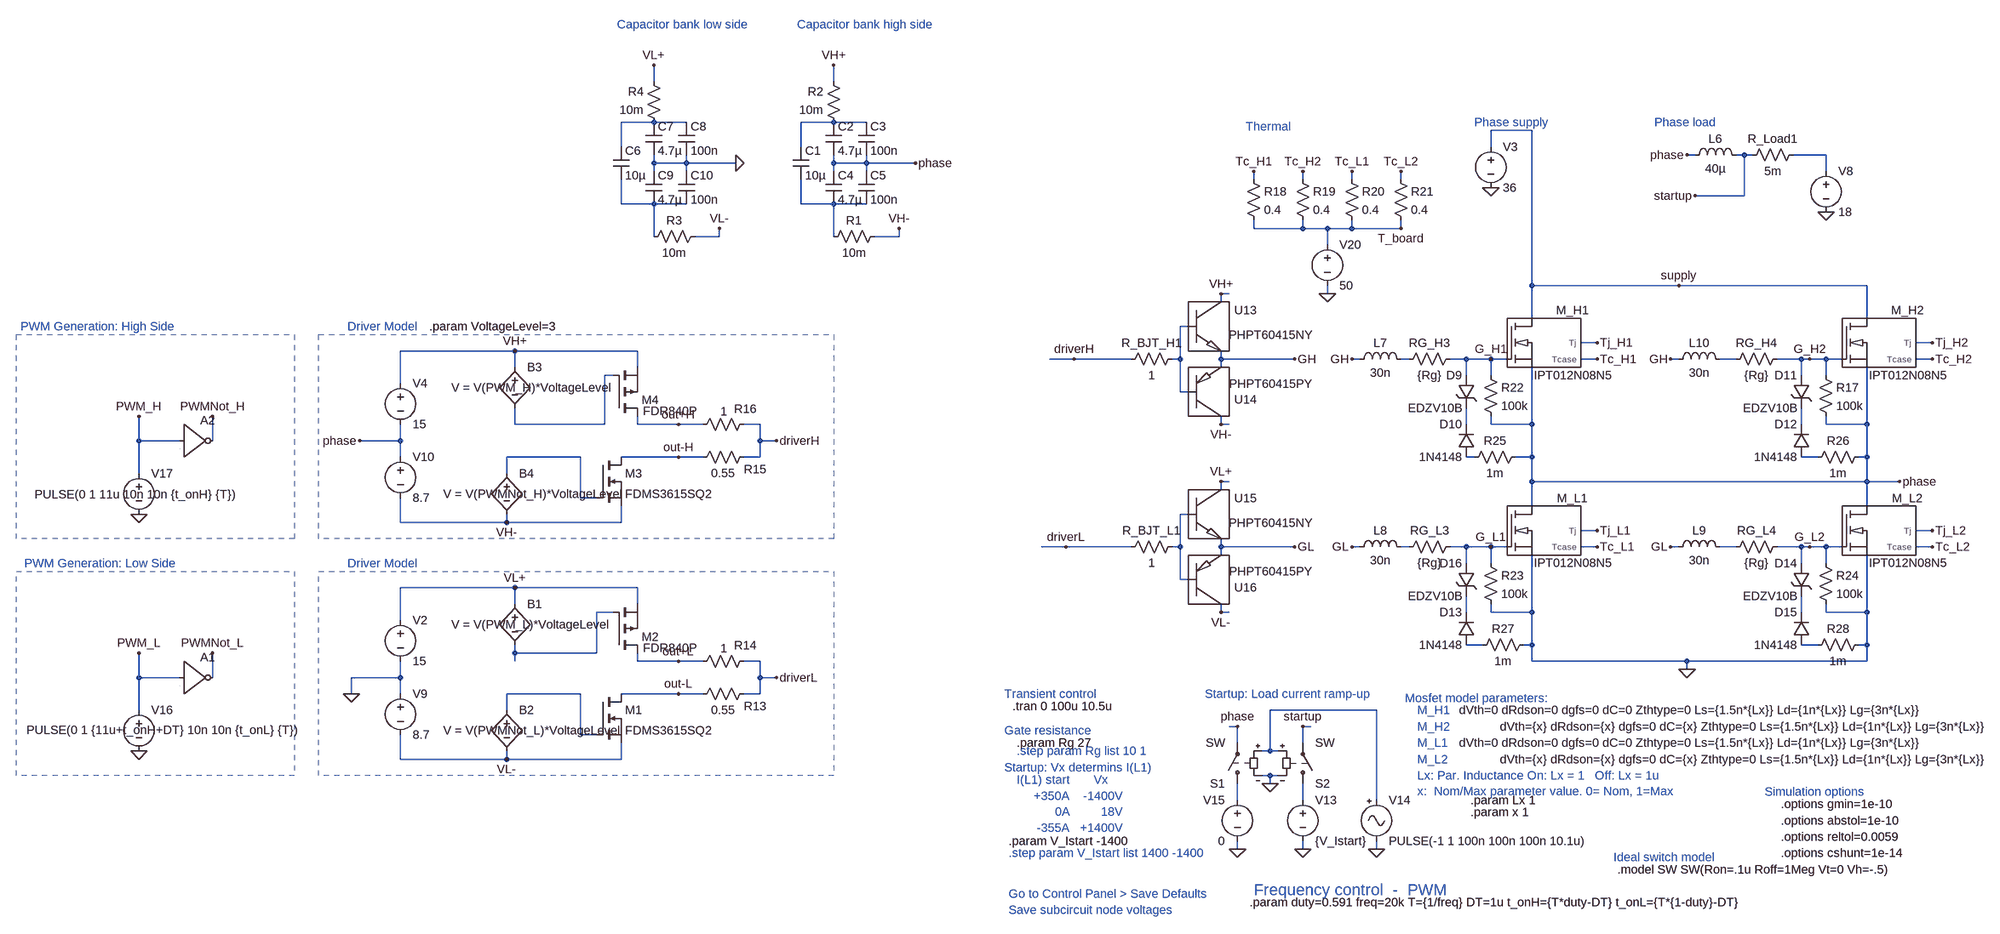
[diagram p0: schematic Gate_drive_fixed_PWM_80V_newFa.asc]
Gate_drive_fixed_PWM_80V_newFa.asc, the LTspice schematic file:
Version 4
SHEET 1 5608 2636
WIRE -624 -960 -624 -992
WIRE -272 -960 -272 -992
WIRE -624 -880 -688 -880
WIRE -560 -880 -624 -880
WIRE -272 -880 -336 -880
WIRE -208 -880 -272 -880
WIRE 1136 -864 1056 -864
WIRE -688 -832 -688 -880
WIRE -336 -832 -336 -880
WIRE 1056 -832 1056 -864
WIRE 1456 -816 1440 -816
WIRE 1552 -816 1536 -816
WIRE 1568 -816 1552 -816
WIRE 1712 -816 1648 -816
WIRE -624 -800 -624 -816
WIRE -560 -800 -560 -816
WIRE -560 -800 -624 -800
WIRE -464 -800 -560 -800
WIRE -272 -800 -272 -816
WIRE -208 -800 -208 -816
WIRE -208 -800 -272 -800
WIRE -112 -800 -208 -800
WIRE -624 -784 -624 -800
WIRE -560 -784 -560 -800
WIRE -272 -784 -272 -800
WIRE -208 -784 -208 -800
WIRE 1712 -784 1712 -816
WIRE 592 -768 592 -784
WIRE 688 -768 688 -784
WIRE 784 -768 784 -784
WIRE 880 -768 880 -784
WIRE 1552 -736 1552 -816
WIRE 1552 -736 1456 -736
WIRE -688 -720 -688 -768
WIRE -624 -720 -688 -720
WIRE -560 -720 -624 -720
WIRE -336 -720 -336 -768
WIRE -272 -720 -336 -720
WIRE -208 -720 -272 -720
WIRE 592 -672 592 -688
WIRE 688 -672 688 -688
WIRE 688 -672 592 -672
WIRE 736 -672 688 -672
WIRE 784 -672 784 -688
WIRE 784 -672 736 -672
WIRE 880 -672 880 -688
WIRE 880 -672 784 -672
WIRE -624 -656 -624 -720
WIRE -496 -656 -496 -672
WIRE -496 -656 -544 -656
WIRE -272 -656 -272 -720
WIRE -144 -656 -144 -672
WIRE -144 -656 -192 -656
WIRE 736 -640 736 -672
WIRE 1136 -560 1136 -864
WIRE 1424 -560 1136 -560
WIRE 1792 -560 1424 -560
WIRE 544 -544 528 -544
WIRE 736 -544 736 -560
WIRE 528 -528 528 -544
WIRE 1136 -496 1136 -560
WIRE 1792 -496 1792 -560
WIRE 464 -480 448 -480
WIRE 1264 -448 1232 -448
WIRE 1920 -448 1888 -448
WIRE -896 -432 -1120 -432
WIRE -656 -432 -896 -432
WIRE 240 -416 192 -416
WIRE 352 -416 240 -416
WIRE 448 -416 448 -480
WIRE 448 -416 432 -416
WIRE 528 -416 528 -432
WIRE 672 -416 528 -416
WIRE 800 -416 784 -416
WIRE 896 -416 880 -416
WIRE 1008 -416 976 -416
WIRE 1056 -416 1008 -416
WIRE 1088 -416 1056 -416
WIRE 1264 -416 1232 -416
WIRE 1424 -416 1408 -416
WIRE 1536 -416 1504 -416
WIRE 1664 -416 1616 -416
WIRE 1680 -416 1664 -416
WIRE 1712 -416 1680 -416
WIRE 1744 -416 1712 -416
WIRE 1920 -416 1888 -416
WIRE -896 -400 -896 -432
WIRE -656 -400 -656 -432
WIRE 528 -400 528 -416
WIRE -704 -384 -720 -384
WIRE 1008 -384 1008 -416
WIRE 1056 -384 1056 -416
WIRE 1664 -384 1664 -416
WIRE 1712 -384 1712 -416
WIRE -1120 -368 -1120 -432
WIRE 448 -352 448 -416
WIRE 464 -352 448 -352
WIRE -896 -288 -896 -320
WIRE -720 -288 -720 -384
WIRE -720 -288 -896 -288
WIRE -656 -288 -656 -304
WIRE -576 -288 -656 -288
WIRE -528 -288 -576 -288
WIRE -416 -288 -448 -288
WIRE 528 -288 528 -304
WIRE 544 -288 528 -288
WIRE 1008 -288 1008 -320
WIRE 1056 -288 1056 -304
WIRE 1136 -288 1136 -400
WIRE 1136 -288 1056 -288
WIRE 1664 -288 1664 -320
WIRE 1712 -288 1712 -304
WIRE 1792 -288 1792 -400
WIRE 1792 -288 1712 -288
WIRE -1632 -256 -1632 -304
WIRE -1552 -256 -1632 -256
WIRE -1488 -256 -1488 -304
WIRE -1120 -256 -1120 -288
WIRE -1120 -256 -1200 -256
WIRE -416 -256 -416 -288
WIRE -384 -256 -416 -256
WIRE -1120 -224 -1120 -256
WIRE -768 -224 -912 -224
WIRE -576 -224 -688 -224
WIRE -528 -224 -576 -224
WIRE -416 -224 -416 -256
WIRE -416 -224 -448 -224
WIRE 1024 -224 1008 -224
WIRE 1136 -224 1136 -288
WIRE 1136 -224 1104 -224
WIRE 1696 -224 1664 -224
WIRE 1792 -224 1792 -288
WIRE 1792 -224 1776 -224
WIRE -1632 -192 -1632 -256
WIRE -912 -192 -912 -224
WIRE 544 -176 528 -176
WIRE 1136 -176 1136 -224
WIRE 1792 -176 1792 -224
WIRE 1792 -176 1136 -176
WIRE 1856 -176 1792 -176
WIRE 528 -160 528 -176
WIRE -768 -144 -768 -224
WIRE -736 -144 -768 -144
WIRE 1136 -128 1136 -176
WIRE 1792 -128 1792 -176
WIRE 464 -112 448 -112
WIRE -1120 -96 -1120 -144
WIRE -912 -96 -912 -112
WIRE -912 -96 -1120 -96
WIRE -688 -96 -688 -128
WIRE -688 -96 -912 -96
WIRE 1264 -80 1232 -80
WIRE 1920 -80 1888 -80
WIRE 224 -48 176 -48
WIRE 352 -48 224 -48
WIRE 448 -48 448 -112
WIRE 448 -48 432 -48
WIRE 528 -48 528 -64
WIRE 672 -48 528 -48
WIRE 800 -48 784 -48
WIRE 896 -48 880 -48
WIRE 1008 -48 976 -48
WIRE 1056 -48 1008 -48
WIRE 1088 -48 1056 -48
WIRE 1264 -48 1232 -48
WIRE 1424 -48 1408 -48
WIRE 1536 -48 1504 -48
WIRE 1664 -48 1616 -48
WIRE 1680 -48 1664 -48
WIRE 1712 -48 1680 -48
WIRE 1744 -48 1712 -48
WIRE 1920 -48 1888 -48
WIRE 528 -32 528 -48
WIRE 1008 -16 1008 -48
WIRE 1056 -16 1056 -48
WIRE 1664 -16 1664 -48
WIRE 1712 -16 1712 -48
WIRE 448 16 448 -48
WIRE 464 16 448 16
WIRE -896 32 -1120 32
WIRE -656 32 -896 32
WIRE -896 64 -896 32
WIRE -656 64 -656 32
WIRE -704 80 -736 80
WIRE 528 80 528 64
WIRE 544 80 528 80
WIRE 1008 80 1008 48
WIRE 1056 80 1056 64
WIRE 1136 80 1136 -32
WIRE 1136 80 1056 80
WIRE 1664 80 1664 48
WIRE 1712 80 1712 64
WIRE 1792 80 1792 -32
WIRE 1792 80 1712 80
WIRE -1120 96 -1120 32
WIRE 1040 144 1008 144
WIRE 1136 144 1136 80
WIRE 1136 144 1120 144
WIRE 1696 144 1664 144
WIRE 1792 144 1792 80
WIRE 1792 144 1776 144
WIRE -896 160 -896 144
WIRE -736 160 -736 80
WIRE -736 160 -896 160
WIRE -896 176 -896 160
WIRE -656 176 -656 160
WIRE -576 176 -656 176
WIRE -528 176 -576 176
WIRE -416 176 -448 176
WIRE 1136 176 1136 144
WIRE 1440 176 1136 176
WIRE 1792 176 1792 144
WIRE 1792 176 1440 176
WIRE 1440 192 1440 176
WIRE -1632 208 -1632 160
WIRE -1552 208 -1632 208
WIRE -1488 208 -1488 160
WIRE -1120 208 -1120 176
WIRE -1120 208 -1216 208
WIRE -416 208 -416 176
WIRE -384 208 -416 208
WIRE -1216 240 -1216 208
WIRE -1120 240 -1120 208
WIRE -768 240 -912 240
WIRE -576 240 -688 240
WIRE -528 240 -576 240
WIRE -416 240 -416 208
WIRE -416 240 -448 240
WIRE -1632 272 -1632 208
WIRE -912 272 -912 240
WIRE 832 272 624 272
WIRE 560 304 544 304
WIRE 704 304 688 304
WIRE -768 320 -768 240
WIRE -736 320 -768 320
WIRE 560 336 560 304
WIRE 688 336 688 304
WIRE 624 352 624 272
WIRE 624 352 608 352
WIRE 640 352 624 352
WIRE -1120 368 -1120 320
WIRE -912 368 -912 352
WIRE -912 368 -1120 368
WIRE -688 368 -688 336
WIRE -688 368 -912 368
WIRE 624 400 608 400
WIRE 640 400 624 400
WIRE 624 416 624 400
WIRE 560 448 560 416
WIRE 688 448 688 416
WIRE 832 448 832 272
WIRE 560 544 560 528
WIRE 688 544 688 528
WIRE 832 544 832 528
FLAG -896 -432 VH+
FLAG -912 -96 VH-
FLAG -896 32 VL+
FLAG -912 368 VL-
FLAG -1632 352 0
FLAG -1632 160 PWM_L
FLAG -1488 160 PWMNot_L
FLAG -1216 240 0
FLAG -576 176 out+L
FLAG -576 240 out-L
FLAG -384 208 driverL
FLAG -1632 -112 0
FLAG -1632 -304 PWM_H
FLAG -1488 -304 PWMNot_H
FLAG -576 -288 out+H
FLAG -576 -224 out-H
FLAG -384 -256 driverH
FLAG -1200 -256 phase
FLAG 784 -416 GH
FLAG 1056 -416 G_H1
FLAG 1408 -416 GH
FLAG 1680 -416 G_H2
FLAG 1056 -752 0
FLAG 784 -48 GL
FLAG 1056 -48 G_L1
FLAG 1408 -48 GL
FLAG 1680 -48 G_L2
FLAG 1440 192 0
FLAG 1856 -176 phase
FLAG 672 -416 GH
FLAG 672 -48 GL
FLAG 1712 -704 0
FLAG 1440 -816 phase
FLAG 688 544 0
FLAG 624 416 0
FLAG 832 544 0
FLAG 560 544 0
FLAG 1920 -448 Tj_H2
FLAG 1264 -448 Tj_H1
FLAG 1920 -416 Tc_H2
FLAG 1264 -416 Tc_H1
FLAG 1264 -80 Tj_L1
FLAG 1264 -48 Tc_L1
FLAG 1920 -80 Tj_L2
FLAG 1920 -48 Tc_L2
FLAG 528 -544 VH+
FLAG 528 -288 VH-
FLAG 528 -176 VL+
FLAG 528 80 VL-
FLAG 560 304 phase
FLAG 688 304 startup
FLAG 1456 -736 startup
FLAG 736 -544 0
FLAG 880 -672 T_board
FLAG 592 -784 Tc_H1
FLAG 688 -784 Tc_H2
FLAG 784 -784 Tc_L1
FLAG 880 -784 Tc_L2
FLAG 1424 -560 supply
FLAG 240 -416 driverH
FLAG 224 -48 driverL
FLAG -272 -992 VH+
FLAG -144 -672 VH-
FLAG -112 -800 phase
FLAG -624 -992 VL+
FLAG -496 -672 VL-
FLAG -464 -800 0
SYMBOL voltage -1120 80 R0
WINDOW 123 0 0 Left 2
WINDOW 39 0 0 Left 2
SYMATTR InstName V2
SYMATTR Value 15
SYMBOL voltage -1120 224 R0
WINDOW 123 0 0 Left 2
WINDOW 39 0 0 Left 2
SYMATTR InstName V9
SYMATTR Value 8.7
SYMBOL nmos -736 240 R0
SYMATTR InstName M1
SYMATTR Value FDMS3615SQ2
SYMBOL pmos -704 160 M180
WINDOW 3 59 10 Left 2
SYMATTR Value FDR840P
SYMATTR InstName M2
SYMBOL res -432 224 R90
WINDOW 0 56 -6 VBottom 2
WINDOW 3 32 56 VTop 2
SYMATTR InstName R13
SYMATTR Value 0.55
SYMBOL res -432 160 R90
WINDOW 0 1 13 VBottom 2
WINDOW 3 -25 55 VTop 2
SYMATTR InstName R14
SYMATTR Value 1
SYMBOL voltage -1632 256 R0
WINDOW 123 0 0 Left 2
WINDOW 39 0 0 Left 2
WINDOW 3 -220 55 Left 2
SYMATTR Value PULSE(0 1 {11u+t_onH+DT} 10n 10n {t_onL} {T})
SYMATTR InstName V16
SYMBOL inv -1552 144 R0
SYMATTR InstName A1
SYMBOL bv -896 48 R0
WINDOW 3 -124 56 Left 2
SYMATTR Value V = V(PWM_L)*VoltageLevel
SYMATTR InstName B1
SYMBOL bv -912 256 R0
WINDOW 3 -124 56 Left 2
SYMATTR Value V = V(PWMNot_L)*VoltageLevel
SYMATTR InstName B2
SYMBOL voltage -1120 -384 R0
WINDOW 123 0 0 Left 2
WINDOW 39 0 0 Left 2
SYMATTR InstName V4
SYMATTR Value 15
SYMBOL voltage -1120 -240 R0
WINDOW 123 0 0 Left 2
WINDOW 39 0 0 Left 2
SYMATTR InstName V10
SYMATTR Value 8.7
SYMBOL nmos -736 -224 R0
SYMATTR InstName M3
SYMATTR Value FDMS3615SQ2
SYMBOL pmos -704 -304 M180
WINDOW 3 59 10 Left 2
SYMATTR Value FDR840P
SYMATTR InstName M4
SYMBOL res -432 -240 R90
WINDOW 0 56 -6 VBottom 2
WINDOW 3 32 56 VTop 2
SYMATTR InstName R15
SYMATTR Value 0.55
SYMBOL res -432 -304 R90
WINDOW 0 1 13 VBottom 2
WINDOW 3 -25 55 VTop 2
SYMATTR InstName R16
SYMATTR Value 1
SYMBOL inv -1552 -320 R0
SYMATTR InstName A2
SYMBOL bv -896 -416 R0
WINDOW 3 -124 56 Left 2
SYMATTR Value V = V(PWM_H)*VoltageLevel
SYMATTR InstName B3
SYMBOL bv -912 -208 R0
WINDOW 3 -124 56 Left 2
SYMATTR Value V = V(PWMNot_H)*VoltageLevel
SYMATTR InstName B4
SYMBOL voltage -1632 -208 R0
WINDOW 123 0 0 Left 2
WINDOW 39 0 0 Left 2
WINDOW 3 -204 57 Left 2
SYMATTR Value PULSE(0 1 11u 10n 10n {t_onH} {T})
SYMATTR InstName V17
SYMBOL IPT012N08N5 1152 -448 R0
WINDOW 39 -158 720 Left 2
SYMATTR SpiceLine dVth=0 dRdson=0 dgfs=0 dC=0 Zthtype=0 Ls={1.5n*{Lx}} Ld={1n*{Lx}} Lg={3n*{Lx}}
SYMATTR InstName M_H1
SYMBOL res 880 -400 R270
WINDOW 0 32 56 VTop 2
WINDOW 3 0 56 VBottom 2
SYMATTR InstName RG_H3
SYMATTR Value {Rg}
SYMBOL IPT012N08N5 1808 -448 R0
WINDOW 39 -734 752 Left 2
SYMATTR SpiceLine dVth={x} dRdson={x} dgfs=0 dC={x} Zthtype=0 Ls={1.5n*{Lx}} Ld={1n*{Lx}} Lg={3n*{Lx}}
SYMATTR InstName M_H2
SYMBOL res 1520 -400 R270
WINDOW 0 32 56 VTop 2
WINDOW 3 0 56 VBottom 2
SYMATTR InstName RG_H4
SYMATTR Value {Rg}
SYMBOL voltage 1056 -848 R0
WINDOW 123 0 0 Left 2
WINDOW 39 0 0 Left 2
SYMATTR InstName V3
SYMATTR Value 36
SYMBOL IPT012N08N5 1152 -80 R0
WINDOW 39 -158 416 Left 2
SYMATTR SpiceLine dVth=0 dRdson=0 dgfs=0 dC=0 Zthtype=0 Ls={1.5n*{Lx}} Ld={1n*{Lx}} Lg={3n*{Lx}}
SYMATTR InstName M_L1
SYMBOL res 880 -32 R270
WINDOW 0 32 56 VTop 2
WINDOW 3 0 56 VBottom 2
SYMATTR InstName RG_L3
SYMATTR Value {Rg}
SYMBOL IPT012N08N5 1808 -80 R0
WINDOW 39 -734 448 Left 2
SYMATTR SpiceLine dVth={x} dRdson={x} dgfs=0 dC={x} Zthtype=0 Ls={1.5n*{Lx}} Ld={1n*{Lx}} Lg={3n*{Lx}}
SYMATTR InstName M_L2
SYMBOL res 1520 -32 R270
WINDOW 0 32 56 VTop 2
WINDOW 3 0 56 VBottom 2
SYMATTR InstName RG_L4
SYMATTR Value {Rg}
SYMBOL ind 1440 -800 R270
WINDOW 0 32 56 VTop 2
WINDOW 3 5 56 VBottom 2
SYMATTR InstName L6
SYMATTR Value 40µ
SYMBOL res 1552 -800 R270
WINDOW 0 32 56 VTop 2
WINDOW 3 0 56 VBottom 2
SYMATTR InstName R_Load1
SYMATTR Value 5m
SYMBOL voltage 1712 -800 R0
WINDOW 123 0 0 Left 2
WINDOW 39 0 0 Left 2
SYMATTR InstName V8
SYMATTR Value 18
SYMBOL PHPT60415NY 512 -480 R0
SYMATTR InstName U13
SYMBOL PHPT60415PY 512 -352 M180
SYMATTR InstName U14
SYMBOL res 448 -432 R90
WINDOW 0 0 56 VBottom 2
WINDOW 3 32 56 VTop 2
SYMATTR InstName R_BJT_H1
SYMATTR Value 1
SYMBOL sw 560 432 R180
SYMATTR InstName S1
SYMBOL sw 688 432 M180
SYMATTR InstName S2
SYMBOL voltage 688 432 R0
WINDOW 123 0 0 Left 2
WINDOW 39 0 0 Left 2
SYMATTR InstName V13
SYMATTR Value {V_Istart}
SYMBOL signal 832 432 R0
WINDOW 123 0 0 Left 2
WINDOW 39 0 0 Left 2
SYMATTR InstName V14
SYMATTR Value PULSE(-1 1 100n 100n 100n 10.1u)
SYMBOL voltage 560 432 M0
WINDOW 123 0 0 Left 2
WINDOW 39 0 0 Left 2
SYMATTR InstName V15
SYMATTR Value 0
SYMBOL res 1696 -400 R0
SYMATTR InstName R17
SYMATTR Value 100k
SYMBOL zener 1024 -384 M0
SYMATTR InstName D9
SYMATTR Value EDZV10B
SYMATTR Description Diode
SYMATTR Type diode
SYMBOL diode 1024 -224 R180
WINDOW 0 24 64 Left 2
WINDOW 3 24 0 Left 2
SYMATTR InstName D10
SYMATTR Value 1N4148
SYMBOL PHPT60415NY 512 -112 R0
SYMATTR InstName U15
SYMBOL PHPT60415PY 512 16 M180
SYMATTR InstName U16
SYMBOL res 448 -64 R90
WINDOW 0 0 56 VBottom 2
WINDOW 3 32 56 VTop 2
SYMATTR InstName R_BJT_L1
SYMATTR Value 1
SYMBOL voltage 736 -656 R0
WINDOW 123 0 0 Left 2
WINDOW 39 0 0 Left 2
SYMATTR InstName V20
SYMATTR Value 50
SYMBOL res 576 -784 R0
SYMATTR InstName R18
SYMATTR Value 0.4
SYMBOL res 672 -784 R0
SYMATTR InstName R19
SYMATTR Value 0.4
SYMBOL res 768 -784 R0
SYMATTR InstName R20
SYMATTR Value 0.4
SYMBOL res 864 -784 R0
SYMATTR InstName R21
SYMATTR Value 0.4
SYMBOL zener 1680 -384 M0
SYMATTR InstName D11
SYMATTR Value EDZV10B
SYMATTR Description Diode
SYMATTR Type diode
SYMBOL diode 1680 -224 R180
WINDOW 0 24 64 Left 2
WINDOW 3 24 0 Left 2
SYMATTR InstName D12
SYMATTR Value 1N4148
SYMBOL diode 1024 144 R180
WINDOW 0 24 64 Left 2
WINDOW 3 24 0 Left 2
SYMATTR InstName D13
SYMATTR Value 1N4148
SYMBOL zener 1680 -16 M0
SYMATTR InstName D14
SYMATTR Value EDZV10B
SYMATTR Description Diode
SYMATTR Type diode
SYMBOL diode 1680 144 R180
WINDOW 0 24 64 Left 2
WINDOW 3 24 0 Left 2
SYMATTR InstName D15
SYMATTR Value 1N4148
SYMBOL res 1040 -400 R0
SYMATTR InstName R22
SYMATTR Value 100k
SYMBOL res 1040 -32 R0
SYMATTR InstName R23
SYMATTR Value 100k
SYMBOL res 1696 -32 R0
SYMATTR InstName R24
SYMATTR Value 100k
SYMBOL res 1120 -240 R90
WINDOW 0 0 56 VBottom 2
WINDOW 3 32 56 VTop 2
SYMATTR InstName R25
SYMATTR Value 1m
SYMBOL res 1792 -240 R90
WINDOW 0 0 56 VBottom 2
WINDOW 3 32 56 VTop 2
SYMATTR InstName R26
SYMATTR Value 1m
SYMBOL res 1136 128 R90
WINDOW 0 0 56 VBottom 2
WINDOW 3 32 56 VTop 2
SYMATTR InstName R27
SYMATTR Value 1m
SYMBOL res 1792 128 R90
WINDOW 0 0 56 VBottom 2
WINDOW 3 32 56 VTop 2
SYMATTR InstName R28
SYMATTR Value 1m
SYMBOL ind 784 -400 R270
WINDOW 0 32 56 VTop 2
WINDOW 3 5 56 VBottom 2
SYMATTR InstName L7
SYMATTR Value 30n
SYMBOL ind 784 -32 R270
WINDOW 0 32 56 VTop 2
WINDOW 3 5 56 VBottom 2
SYMATTR InstName L8
SYMATTR Value 30n
SYMBOL ind 1408 -32 R270
WINDOW 0 32 56 VTop 2
WINDOW 3 5 56 VBottom 2
SYMATTR InstName L9
SYMATTR Value 30n
SYMBOL ind 1408 -400 R270
WINDOW 0 32 56 VTop 2
WINDOW 3 5 56 VBottom 2
SYMATTR InstName L10
SYMATTR Value 30n
SYMBOL zener 1024 -16 M0
SYMATTR InstName D16
SYMATTR Value EDZV10B
SYMATTR Description Diode
SYMATTR Type diode
SYMBOL cap -352 -832 R0
SYMATTR InstName C1
SYMATTR Value 10µ
SYMBOL cap -288 -880 R0
SYMATTR InstName C2
SYMATTR Value 4.7µ
SYMBOL cap -224 -880 R0
SYMATTR InstName C3
SYMATTR Value 100n
SYMBOL cap -288 -784 R0
SYMATTR InstName C4
SYMATTR Value 4.7µ
SYMBOL cap -224 -784 R0
SYMATTR InstName C5
SYMATTR Value 100n
SYMBOL res -176 -672 R90
WINDOW 0 0 56 VBottom 2
WINDOW 3 32 56 VTop 2
SYMATTR InstName R1
SYMATTR Value 10m
SYMBOL res -256 -864 R180
WINDOW 0 36 76 Left 2
WINDOW 3 36 40 Left 2
SYMATTR InstName R2
SYMATTR Value 10m
SYMBOL cap -704 -832 R0
SYMATTR InstName C6
SYMATTR Value 10µ
SYMBOL cap -640 -880 R0
SYMATTR InstName C7
SYMATTR Value 4.7µ
SYMBOL cap -576 -880 R0
SYMATTR InstName C8
SYMATTR Value 100n
SYMBOL cap -640 -784 R0
SYMATTR InstName C9
SYMATTR Value 4.7µ
SYMBOL cap -576 -784 R0
SYMATTR InstName C10
SYMATTR Value 100n
SYMBOL res -528 -672 R90
WINDOW 0 0 56 VBottom 2
WINDOW 3 32 56 VTop 2
SYMATTR InstName R3
SYMATTR Value 10m
SYMBOL res -608 -864 R180
WINDOW 0 36 76 Left 2
WINDOW 3 36 40 Left 2
SYMATTR InstName R4
SYMATTR Value 10m
TEXT -1856 -16 Left 2 ;PWM Generation: Low Side
TEXT -1224 -16 Left 2 ;Driver Model
TEXT -1064 -480 Left 2 !.param VoltageLevel=3
TEXT -1864 -480 Left 2 ;PWM Generation: High Side
TEXT -1224 -480 Left 2 ;Driver Model
TEXT 120 264 Left 2 !.tran 0 100u 10.5u
TEXT 1624 552 Left 2 !.options cshunt=1e-14
TEXT 1624 456 Left 2 !.options gmin=1e-10
TEXT 1624 488 Left 2 !.options abstol=1e-10
TEXT 1624 520 Left 2 !.options reltol=0.0059
TEXT 1304 584 Left 2 !.model SW SW(Ron=.1u Roff=1Meg Vt=0 Vh=-.5)
TEXT 128 336 Left 2 !.param Rg 27
TEXT 1016 448 Left 2 !.param Lx 1
TEXT 912 272 Left 2 ;M_H1
TEXT 912 304 Left 2 ;M_H2
TEXT 912 336 Left 2 ;M_L1
TEXT 912 368 Left 2 ;M_L2
TEXT 912 400 Left 2 ;Lx: Par. Inductance On: Lx = 1   Off: Lx = 1u\nx:  Nom/Max parameter value. 0= Nom, 1=Max
TEXT 104 312 Left 2 ;Gate resistance
TEXT 888 248 Left 2 ;Mosfet model parameters:
TEXT 576 -872 Left 2 ;Thermal
TEXT 1024 -880 Left 2 ;Phase supply
TEXT 1376 -880 Left 2 ;Phase load
TEXT 1592 432 Left 2 ;Simulation options
TEXT 104 240 Left 2 ;Transient control
TEXT 496 240 Left 2 ;Startup: Load current ramp-up
TEXT 128 408 Left 2 ;I(L1) start       Vx
TEXT 1296 560 Left 2 ;Ideal switch model
TEXT 112 528 Left 2 !.param V_Istart -1400
TEXT 112 552 Left 2 ;.step param V_Istart list 1400 -1400
TEXT 104 384 Left 2 ;Startup: Vx determins I(L1)
TEXT 232 440 Right 2 ;+350A\n0A\n-355A
TEXT 336 440 Right 2 ;-1400V\n18V\n+1400V
TEXT 128 352 Left 2 ;.step param Rg list 10 1
TEXT 112 632 Left 2 ;Go to Control Panel > Save Defaults\nSave subcircuit node voltages
TEXT 584 648 Left 2 !.param duty=0.591 freq=20k T={1/freq} DT=1u t_onH={T*duty-DT} t_onL={T*{1-duty}-DT}
TEXT 592 624 Left 3 ;Frequency control  -  PWM
TEXT 1016 472 Left 2 !.param x 1
TEXT -344 -1072 Left 2 ;Capacitor bank high side
TEXT -696 -1072 Left 2 ;Capacitor bank low side
RECTANGLE Normal -1328 400 -1872 0 2
RECTANGLE Normal -1328 -64 -1872 -464 2
RECTANGLE Normal -272 -64 -1280 -464 2
RECTANGLE Normal -272 400 -1280 0 2

The netlist it stands for:
* Gate_drive_fixed_PWM_80V_newFa.asc
V2 VL+ 0 15
V9 0 VL- 8.7
M1 out-L N023 VL- VL- FDMS3615SQ2
M2 out+L N018 VL+ VL+ FDR840P
R13 driverL out-L 0.55
R14 driverL out+L 1
V16 PWM_L 0 PULSE(0 1 {11u+t_onH+DT} 10n 10n {t_onL} {T})
A1 PWM_L 0 0 0 0 PWMNot_L 0 0 BUF
B1 VL+ N018 V = V(PWM_L)*VoltageLevel
B2 N023 VL- V = V(PWMNot_L)*VoltageLevel
V4 VH+ phase 15
V10 phase VH- 8.7
M3 out-H N012 VH- VH- FDMS3615SQ2
M4 out+H N009 VH+ VH+ FDR840P
R15 driverH out-H 0.55
R16 driverH out+H 1
A2 PWM_H 0 0 0 0 PWMNot_H 0 0 BUF
B3 VH+ N009 V = V(PWM_H)*VoltageLevel
B4 N012 VH- V = V(PWMNot_H)*VoltageLevel
V17 PWM_H 0 PULSE(0 1 11u 10n 10n {t_onH} {T})
XM_H1 supply G_H1 phase Tj_H1 Tc_H1 IPT012N08N5 dVth=0 dRdson=0 dgfs=0 dC=0 Zthtype=0 Ls={1.5n*{Lx}} Ld={1n*{Lx}} Lg={3n*{Lx}}  ; pins drain gate source Tj Tcase
RG_H3 N007 G_H1 {Rg}
XM_H2 supply G_H2 phase Tj_H2 Tc_H2 IPT012N08N5 dVth={x} dRdson={x} dgfs=0 dC={x} Zthtype=0 Ls={1.5n*{Lx}} Ld={1n*{Lx}} Lg={3n*{Lx}}  ; pins drain gate source Tj Tcase
RG_H4 N008 G_H2 {Rg}
V3 supply 0 36
XM_L1 phase G_L1 0 Tj_L1 Tc_L1 IPT012N08N5 dVth=0 dRdson=0 dgfs=0 dC=0 Zthtype=0 Ls={1.5n*{Lx}} Ld={1n*{Lx}} Lg={3n*{Lx}}  ; pins drain gate source Tj Tcase
RG_L3 N016 G_L1 {Rg}
XM_L2 phase G_L2 0 Tj_L2 Tc_L2 IPT012N08N5 dVth={x} dRdson={x} dgfs=0 dC={x} Zthtype=0 Ls={1.5n*{Lx}} Ld={1n*{Lx}} Lg={3n*{Lx}}  ; pins drain gate source Tj Tcase
RG_L4 N017 G_L2 {Rg}
L6 phase startup 40µ
R_Load1 startup N003 5m
V8 N003 0 18
XU13 VH+ N006 GH PHPT60415NY  ; pins 1 2 3
XU14 VH- N006 GH PHPT60415PY  ; pins 1 2 3
R_BJT_H1 N006 driverH 1
S1 N025 phase N024 0 SW
S2 N026 startup N024 0 SW
V13 N026 0 {V_Istart}
V14 N024 0 PULSE(-1 1 100n 100n 100n 10.1u)
V15 N025 0 0
R17 G_H2 phase 100k
D9 G_H1 N010 EDZV10B
D10 N013 N010 1N4148
XU15 VL+ N015 GL PHPT60415NY  ; pins 1 2 3
XU16 VL- N015 GL PHPT60415PY  ; pins 1 2 3
R_BJT_L1 N015 driverL 1
V20 T_board 0 50
R18 Tc_H1 T_board 0.4
R19 Tc_H2 T_board 0.4
R20 Tc_L1 T_board 0.4
R21 Tc_L2 T_board 0.4
D11 G_H2 N011 EDZV10B
D12 N014 N011 1N4148
D13 N021 N019 1N4148
D14 G_L2 N020 EDZV10B
D15 N022 N020 1N4148
R22 G_H1 phase 100k
R23 G_L1 0 100k
R24 G_L2 0 100k
R25 phase N013 1m
R26 phase N014 1m
R27 0 N021 1m
R28 0 N022 1m
L7 GH N007 30n
L8 GL N016 30n
L9 GL N017 30n
L10 GH N008 30n
D16 G_L1 N019 EDZV10B
C1 N002 N005 10µ
C2 N002 phase 4.7µ
C3 N002 phase 100n
C4 phase N005 4.7µ
C5 phase N005 100n
R1 VH- N005 10m
R2 N002 VH+ 10m
C6 N001 N004 10µ
C7 N001 0 4.7µ
C8 N001 0 100n
C9 0 N004 4.7µ
C10 0 N004 100n
R3 VL- N004 10m
R4 N001 VL+ 10m
.model D D
.lib standard.dio
.model NMOS NMOS
.model PMOS PMOS
.lib standard.mos
* PWM Generation: Low Side
* Driver Model
.param VoltageLevel=3
* PWM Generation: High Side
* Driver Model
.tran 0 100u 10.5u
.options cshunt=1e-14
.options gmin=1e-10
.options abstol=1e-10
.options reltol=0.0059
.model SW SW(Ron=.1u Roff=1Meg Vt=0 Vh=-.5)
.param Rg 27
.param Lx 1
* M_H1
* M_H2
* M_L1
* M_L2
* Lx: Par. Inductance On: Lx = 1   Off: Lx = 1u
* x:  Nom/Max parameter value. 0= Nom, 1=Max
* Gate resistance
* Mosfet model parameters:
* Thermal
* Phase supply
* Phase load
* Simulation options
* Transient control
* Startup: Load current ramp-up
* I(L1) start       Vx
* Ideal switch model
.param V_Istart -1400
* .step param V_Istart list 1400 -1400
* Startup: Vx determins I(L1)
* +350A
* 0A
* -355A
* -1400V
* 18V
* +1400V
* .step param Rg list 10 1
* Go to Control Panel > Save Defaults
* Save subcircuit node voltages
.param duty=0.591 freq=20k T={1/freq} DT=1u t_onH={T*duty-DT} t_onL={T*{1-duty}-DT}
* Frequency control  -  PWM
.param x 1
* Capacitor bank high side
* Capacitor bank low side
.lib OptiMOS5_80V_PSpice.lib
.lib PHPT60415NY.lib
.lib PHPT60415PY.lib
.backanno
.end